# EAGLE design clock (EAGLE 7.3.0)
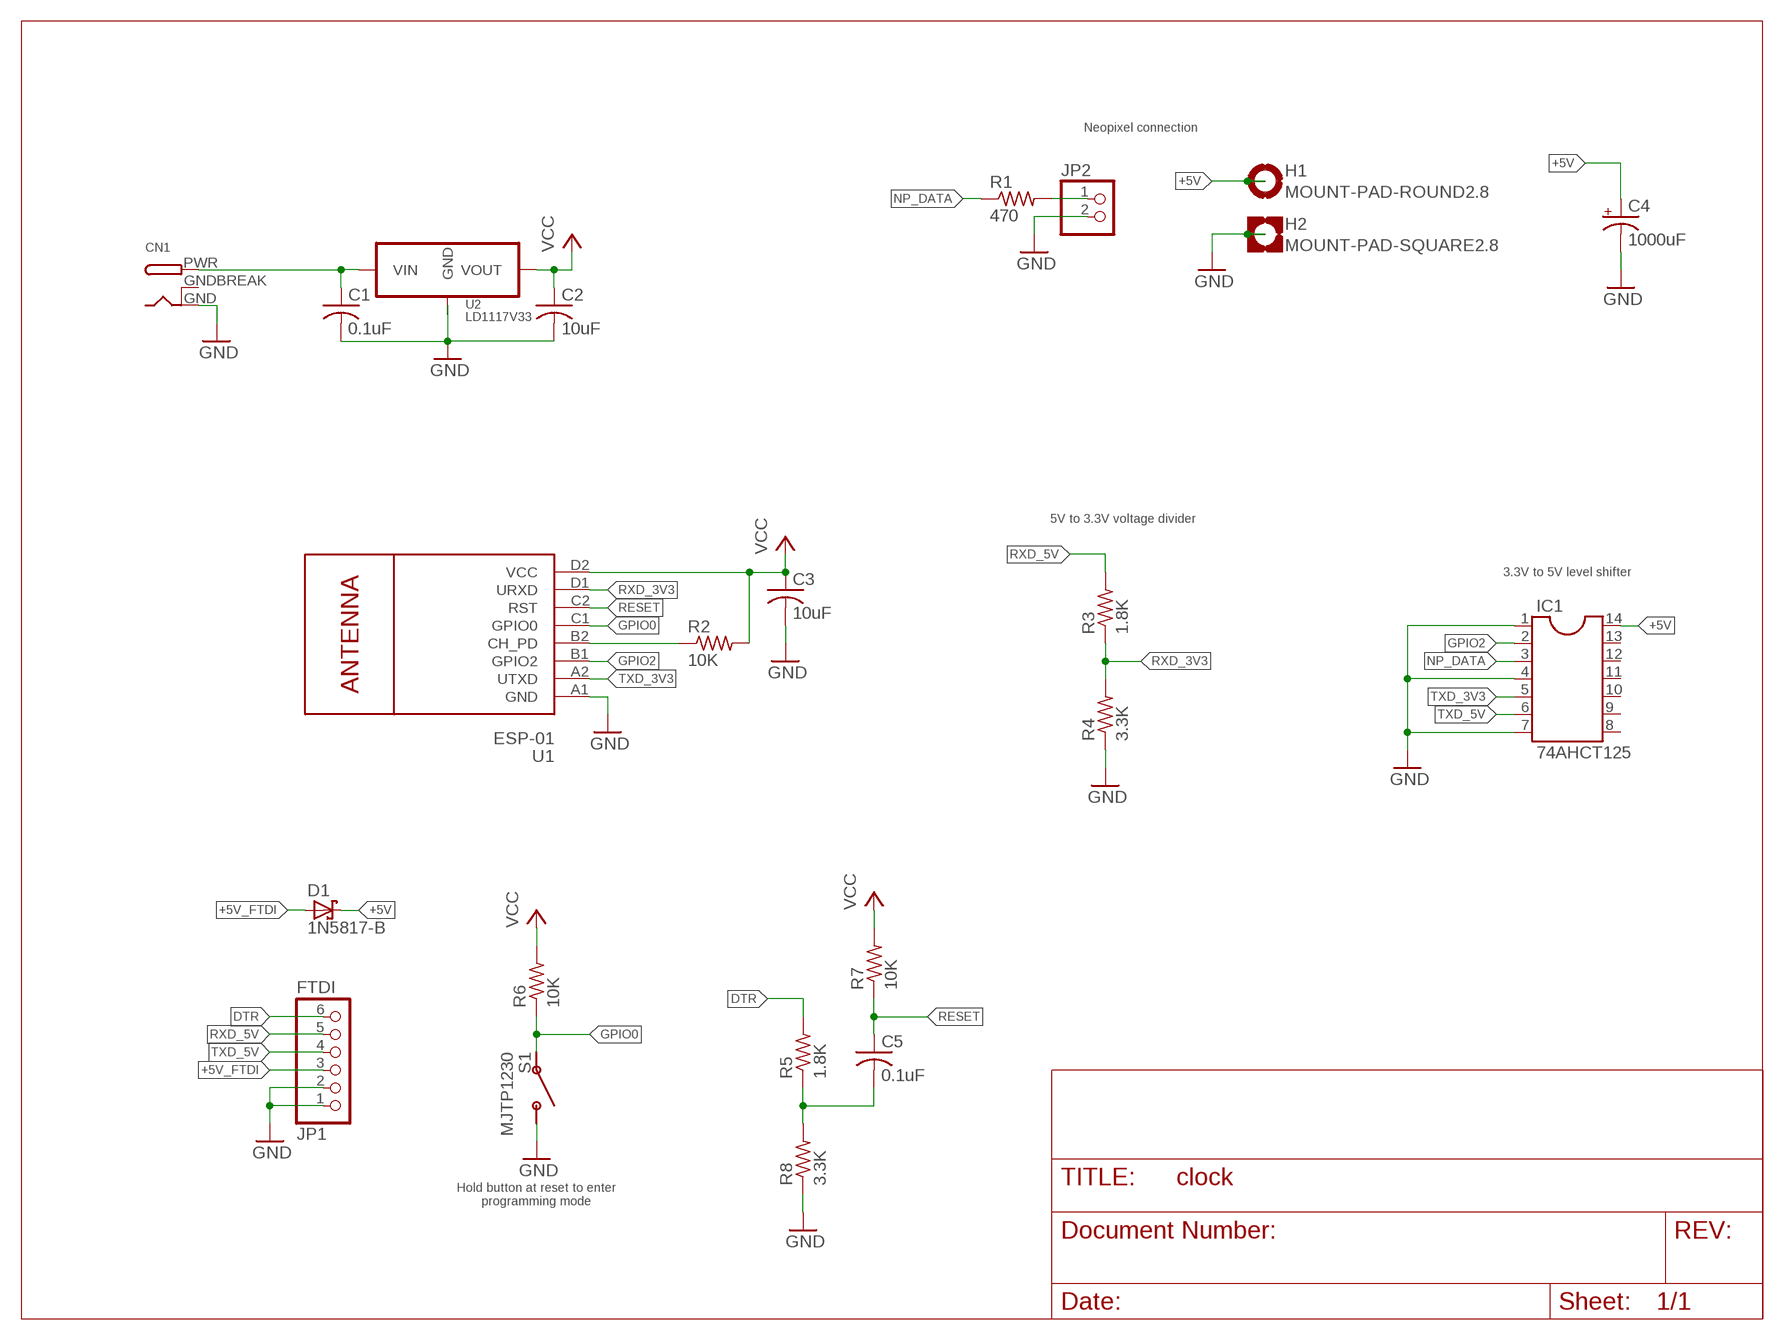
[diagram p0: schematic, sheet 1]

## Parts
C1  0.1uF  C-US025-025X050  [C025-025X050]
C2  10uF  C-US025-025X050  [C025-025X050]
C3  10uF  C-US025-025X050  [C025-025X050]
C4  1000uF  CPOL-USE3.5-8  [E3,5-8]
C5  0.1uF  C-US025-025X050  [C025-025X050]
CN1  DCBARRELPTH  [DCJACK_2MM_PTH]
D1  1N5817-B  [DO41-7.6]
H1  MOUNT-PAD-ROUND2.8  [2,8-PAD]
H2  MOUNT-PAD-SQUARE2.8  [2,8-PAD-SQUARE]
IC1  74AHCT125  DIL14  [DIL14]
JP1  FTDI  PINHD-1X6/90  [1X06/90]
JP2  PINHD-1X2  [1X02]
R1  470  R-US_0204/5  [0204/5]
R2  10K  R-US_0204/5  [0204/5]
R3  1.8K  R-US_0204/5  [0204/5]
R4  3.3K  R-US_0204/5  [0204/5]
R5  1.8K  R-US_0204/5  [0204/5]
R6  10K  R-US_0204/5  [0204/5]
R7  10K  R-US_0204/5  [0204/5]
R8  3.3K  R-US_0204/5  [0204/5]
S1  MJTP1230  TACTILE-BUTTON-MJTP1230  [TACTILE-BUTTON-MJTP1230]
U1  ESP-01  WIRELESS-WIFI-ESP-01  [WIRELESS-WIFI-ESP-01]
U2  LD1117V33  LD1117  [TO-220]

## Nets
+5V: C1.1 C4.+ CN1.PWR D1.C H1.B2,8(MOUNT) IC1.14 U2.P$3(VIN)
+5V_FTDI: D1.A JP1.3
DTR: JP1.6 R5.2
GND: C1.2 C2.2 C3.2 C4.- CN1.GND H2.B2,8(MOUNT) IC1.1 IC1.4 IC1.7 JP1.1 JP1.2 JP2.2 R4.1 R8.1 S1.P$2 S1.P$4 U1.A1(GND)
GPIO0: R6.1 S1.P$1 S1.P$3 U1.C1(GPIO0)
GPIO2: IC1.2 U1.B1(GPIO2)
N$1: JP2.1 R1.2
N$2: C5.2 R5.1 R8.2
N$4: R2.1 U1.B2(CH_PD)
NP_DATA: IC1.3 R1.1
RESET: C5.1 R7.1 U1.C2(RST)
RXD_3V3: R3.1 R4.2 U1.D1(URXD)
RXD_5V: JP1.5 R3.2
TXD_3V3: IC1.5 U1.A2(UTXD)
TXD_5V: IC1.6 JP1.4
VCC: C2.1 C3.1 R2.2 R6.2 R7.2 U1.D2(VCC) U2.P$2(VOUT) U2.P$4(VOUT)
Unconnected: IC1.8 IC1.9 IC1.10 IC1.11 IC1.12 IC1.13

## Notes on the sheet
- Neopixel connection
- 5V to 3.3V voltage divider
- 3.3V to 5V level shifter
- Hold button at reset to enter
  programming mode

## Power pins joined to a net without a drawn wire
GND: U2.P$1(GND)
GNDBREAK: CN1.GNDBREAK

## Library data of the parts
C1-C3 C5 = rcl:C-US: CAPACITOR, American symbol
C4 = rcl:CPOL-US: POLARIZED CAPACITOR, American symbol
CN1 = adafruit:DCBARREL: 2.0mm DC Barrel Jack DCJACK_2MM_PTH - Through Hole Jack (4UConnector: 05537)
D1 = diode:1N581*: 1.0A SCHOTTKY BARRIER RECTIFIER Source: http://www.diodes.com/datasheets/ds23001.pdf
H1 = holes:MOUNT-PAD-ROUND: MOUNTING PAD, round
H2 = holes:MOUNT-PAD-SQUARE: MOUNTING PAD, square
IC1 = ic-package:DIL14: Dual In Line / Socket
JP1 = pinhead:PINHD-1X6: PIN HEADER
JP2 = pinhead:PINHD-1X2: PIN HEADER
R1-R8 = rcl:R-US_: RESISTOR, American symbol
S1 = my-custom:TACTILE-BUTTON-MJTP1230
U1 = diy-modules:WIRELESS-WIFI-ESP-01: Wireless Wi-Fi ESP-01 Module based on ESP8266 chip
U2 = my-custom:LD1117

## Board
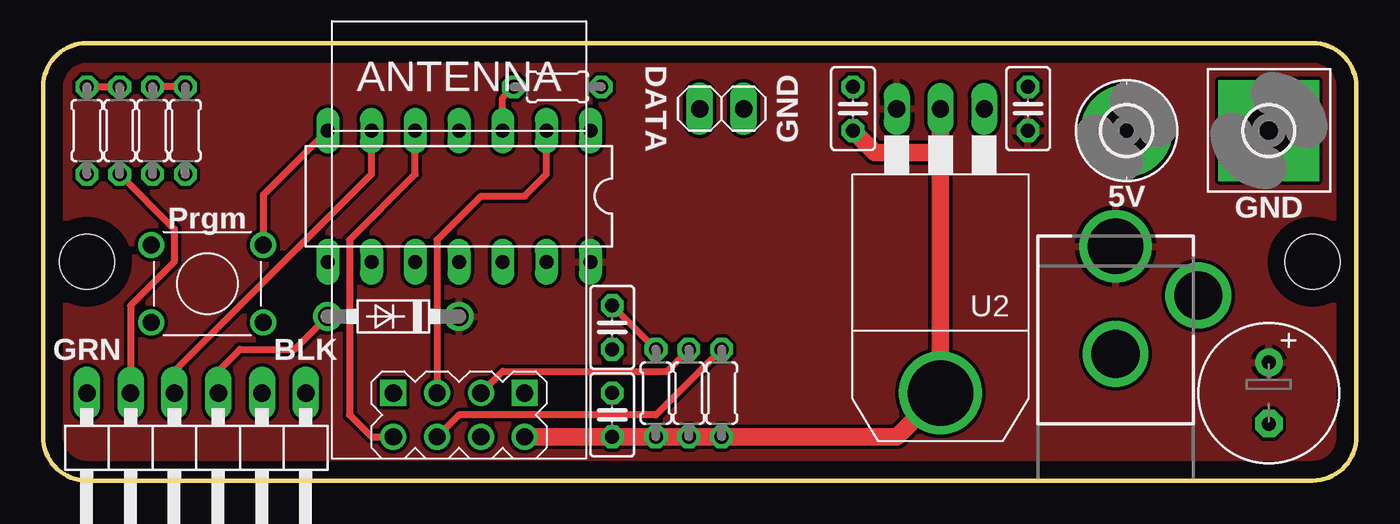
[diagram p1: board, top side]
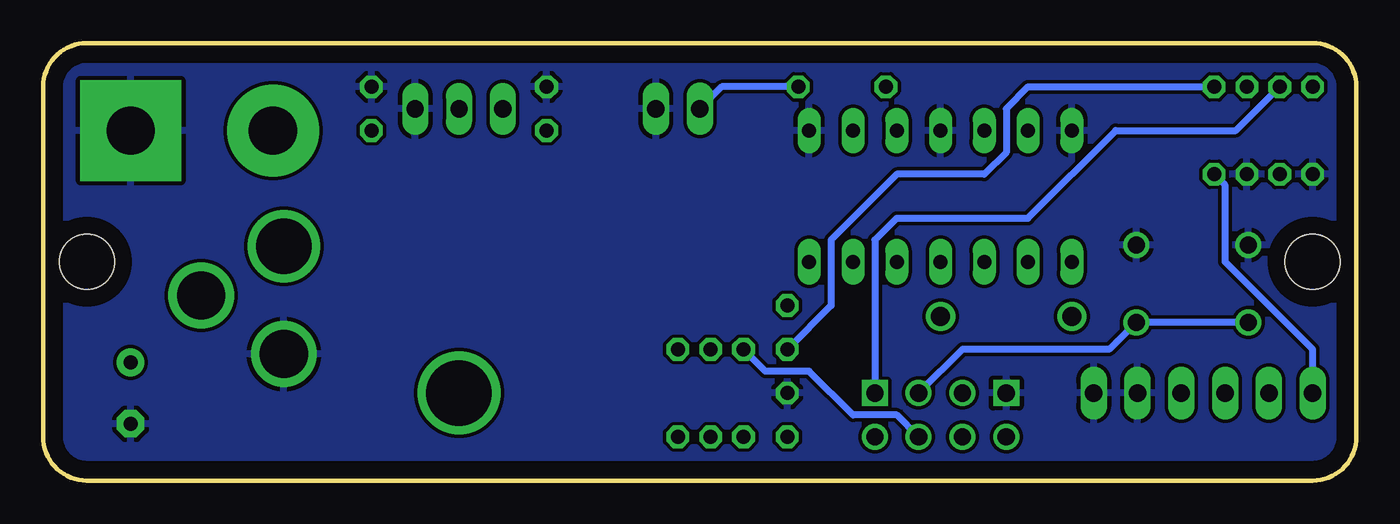
[diagram p2: board, bottom side, seen from below]

Size 76.2 x 25.4 mm. Coordinates in mm from the lower left corner, seen from the top.
Outline: 2.54,0 73.66,0 arc90 76.2,2.54 76.2,22.86 arc90 73.66,25.4 2.54,25.4 arc90 0,22.86 0,2.54 arc90 2.54,0
Copper layers (1*16): Top 0.035mm / dielectric 1.5mm / Bottom 0.035mm
Design rules "default": minimum track width 10mil, minimum drill 24mil, track to track 8mil, track to pad 8mil, pad to pad 8mil, via to via 8mil, smd to smd 8mil, copper to edge 40mil, drill to drill 8mil, minimum pad ring 10mil, minimum via ring 8mil, stop-mask expansion 4mil, vias tented up to drill 0mil, thermal gap 10mil
Holes 3.17 mm at 2.54,12.7 73.66,12.7

### Footprints (pad centres in the part's own frame; a part is rotated, then mirrored left to right if it is on the bottom)
C025-025X050 = drill 0.813 octagon: 1 -1.27,0; 2 1.27,0
E3,5-8 = drill 0.813 pad 1.6: + -1.778,0 | drill 0.813 pad 1.6 octagon: - 1.778,0
DCJACK_2MM_PTH = drill 2.8: GND 0,7.35; GNDBREAK 4.8,10.75 | drill 3.2: PWR 0,13.6
DO41-7.6 = drill 1.1 pad 1.7: A 3.81,0; C -3.81,0
2,8-PAD = drill 2.8 pad 5.334: B2,8 0,0
2,8-PAD-SQUARE = drill 2.8 pad 5.842 square: B2,8 0,0
DIL14 = drill 0.813 long: 1 -7.62,-3.81; 2 -5.08,-3.81; 3 -2.54,-3.81; 4 0,-3.81; 5 2.54,-3.81; 6 5.08,-3.81; 7 7.62,-3.81; 8 7.62,3.81; 9 5.08,3.81; 10 2.54,3.81; 11 0,3.81; 12 -2.54,3.81; 13 -5.08,3.81; 14 -7.62,3.81
1X06/90 = drill 1.016 long: 1 -6.35,-3.81; 2 -3.81,-3.81; 3 -1.27,-3.81; 4 1.27,-3.81; 5 3.81,-3.81; 6 6.35,-3.81
1X02 = drill 1.016 long: 1 -1.27,0; 2 1.27,0
0204/5 = drill 0.813 octagon: 1 -2.54,0; 2 2.54,0
TACTILE-BUTTON-MJTP1230 = drill 1: P$1 -3.25,2.25; P$2 -3.25,-2.25; P$3 3.25,2.25; P$4 3.25,-2.25
WIRELESS-WIFI-ESP-01 = drill 1 square: A1 -8.89,3.81; D1 -8.89,-3.81 | drill 1: A2 -11.43,3.81; B1 -8.89,1.27; B2 -11.43,1.27; C1 -8.89,-1.27; C2 -11.43,-1.27; D2 -11.43,-3.81
TO-220 = drill 1 long: P$1 -2.54,-3.8; P$2 0,-3.8; P$3 2.54,-3.8 | drill 3.8: P$4 0,12.7

### Placement (x,y rotation side)
C1  57.15,21.59 90 top
C2  46.99,21.59 90 top
C3  33.02,3.81 90 top
C4  71.12,5.08 270 top
C5  33.02,8.89 270 top
CN1  62.23,0 0 top
D1  20.32,9.53 180 top
H1  62.87,20.32 0 top
H2  71.12,20.32 0 top
IC1  24.13,16.51 180 top
JP1  8.89,1.27 180 top
JP2  39.37,21.59 0 top
R1  29.84,22.86 0 top
R2  39.37,5.08 270 top
R3  4.45,20.32 270 top
R4  2.54,20.32 90 top
R5  8.26,20.32 270 top
R6  37.47,5.08 270 top
R7  35.56,5.08 270 top
R8  6.35,20.32 90 top
S1  9.53,11.43 180 top
U1  24.13,13.97 90 top
U2  52.07,17.78 180 top

### Tracks (layer width: path | path; a pad name or v marks a point on that pad's centre or on a via)
+5V
  pour Top: 0,0 76.2,0 76.2,25.4 0,25.4
+5V_FTDI
  Top 0.406: JP1.3 10.16,6.35 11.43,7.62 14.61,7.62 D1.A
DTR
  Bottom 0.406: JP1.6 2.54,7.62 7.62,12.7 7.62,17.14 R5.2
GND
  Top 0.406: IC1.7 12.78,16.59 S1.P$2
  pour Bottom: 0,0 76.2,0 76.2,25.4 0,25.4
GPIO0
  Top 0.406: U1.C1 26.67,6.35 36.2,6.35 R6.1
  Bottom 0.406: S1.P$3 S1.P$1 14.34,7.62 22.86,7.62 U1.C1
GPIO2
  Top 0.406: U1.B1 22.86,13.97 25.4,16.51 27.94,16.51 29.21,17.78 IC1.2
N$1
  Bottom 0.406: R1.2 36.83,22.86 JP2.1
N$2
  Top 0.406: R5.1 R8.2
  Bottom 0.406: C5.2 30.48,10.16 30.48,13.97 26.67,17.78 21.59,17.78 20.32,19.05 20.32,21.59 19.05,22.86 R5.1
N$4
  Top 0.406: U1.B2 24.13,3.81 35.56,3.81 R2.1
NP_DATA
  Top 0.406: IC1.3 26.67,22.23 R1.1
RESET
  Top 0.406: C5.1 R7.1
  Bottom 0.406: U1.C2 26.67,3.81 29.21,3.81 31.75,6.35 34.29,6.35 R7.1
RXD_3V3
  Top 0.406: R4.2 R3.1
  Bottom 0.406: U1.D1 27.94,13.97 26.67,15.24 19.05,15.24 13.97,20.32 6.99,20.32 R3.1
RXD_5V
  Top 0.406: JP1.5 5.08,10.16 7.62,12.7 7.62,14.61 R3.2
TXD_3V3
  Top 0.406: U1.A2 19.05,2.54 17.78,3.81 17.78,13.97 21.59,17.78 IC1.5
TXD_5V
  Top 0.406: IC1.6 19.05,17.78 7.62,6.35 JP1.4
VCC
  Top 1.016: 52.07,19.05 U2.P$4 49.53,2.54 R2.2 R6.2 R7.2 C3.1 U1.D2 | U2.P$2 52.07,19.05 | C2.1 48.26,19.05 52.07,19.05

### Text on the board
tPlace: DATA | GND | 5V | GND | GRN | BLK
tNames: Prgm